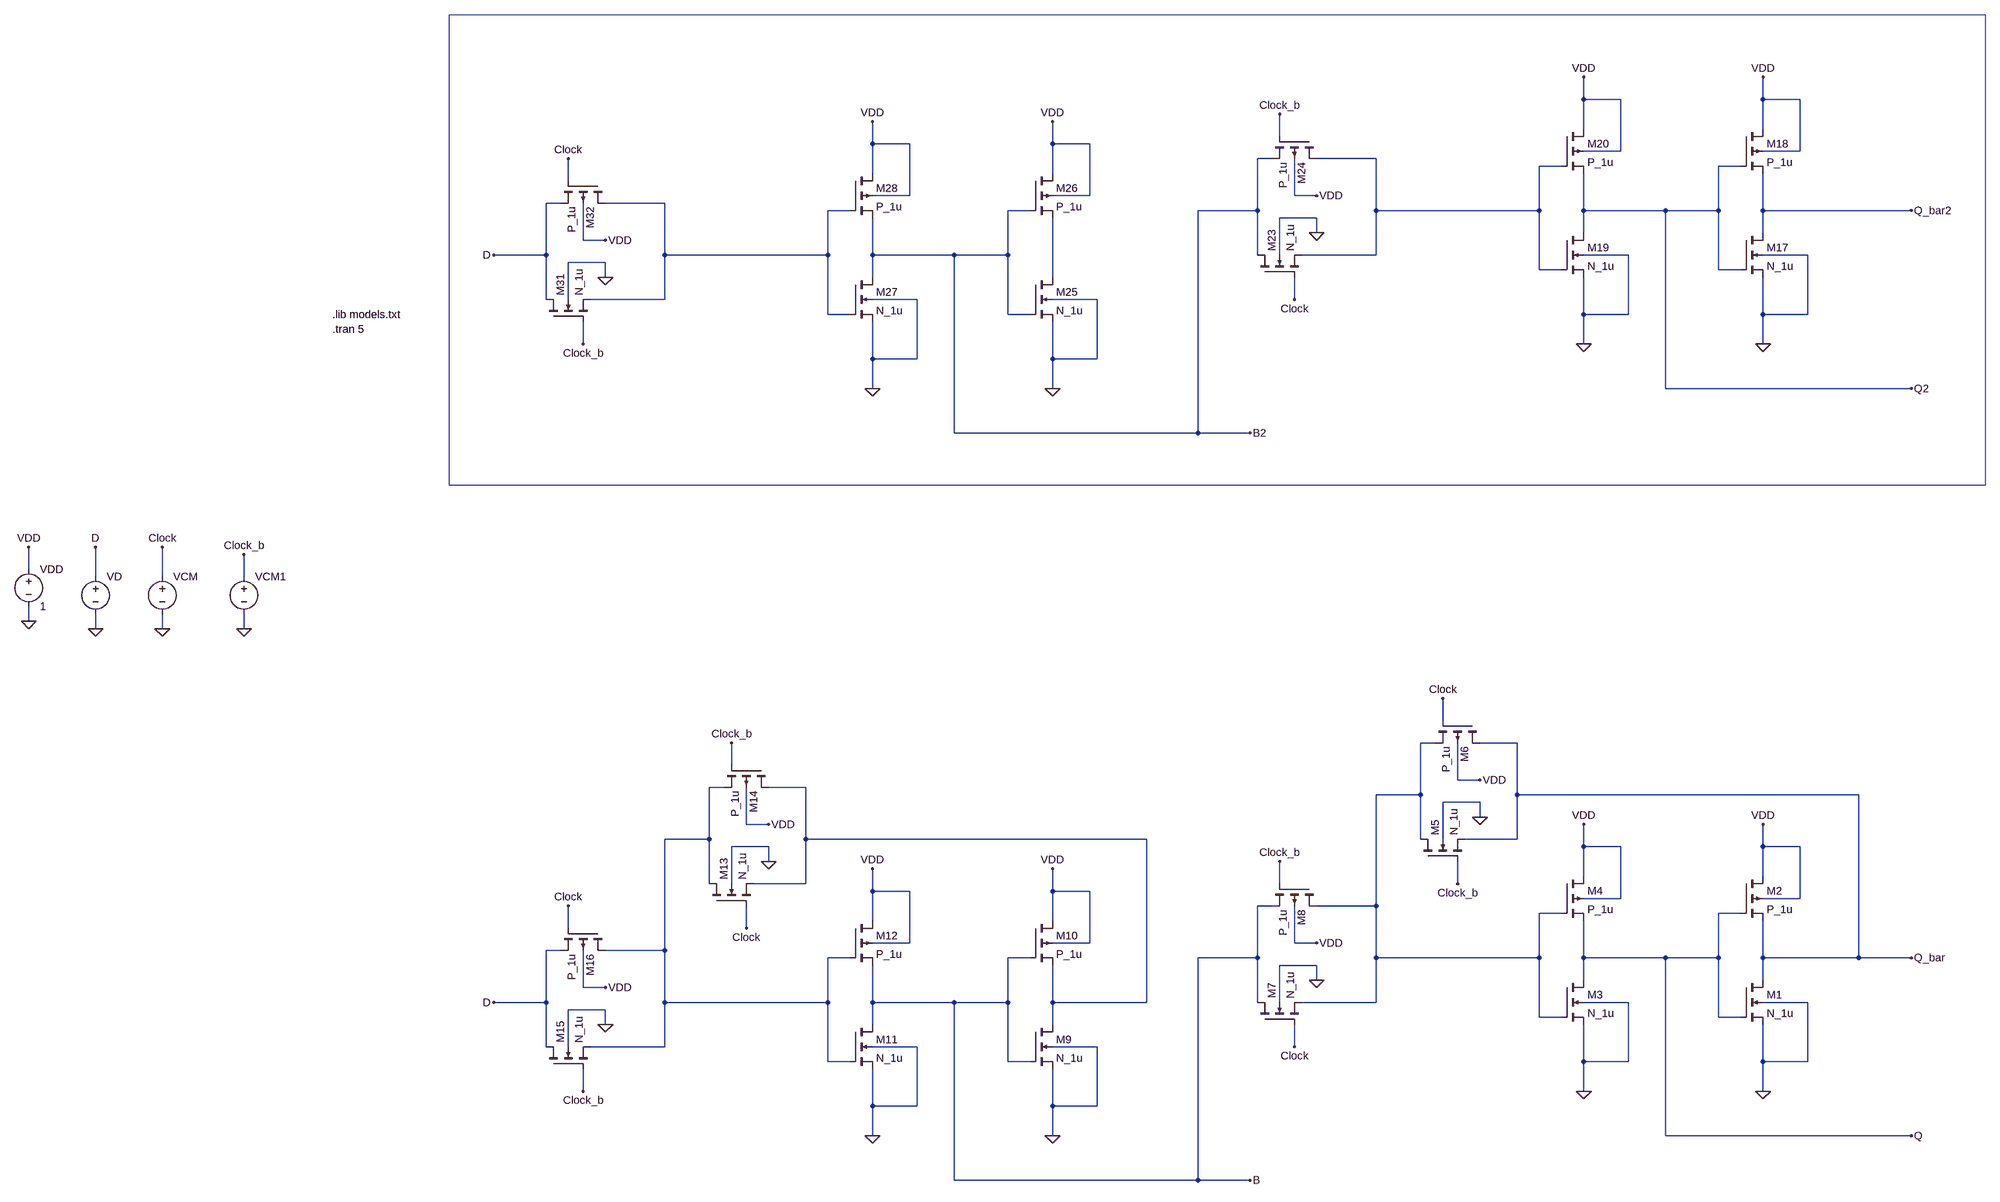
[diagram p0: schematic TP1_ej8.asc]
TP1_ej8.asc, the LTspice schematic file:
Version 4.1
SHEET 1 2084 3372
WIRE 1152 -256 1152 -304
WIRE 1232 -256 1152 -256
WIRE 1552 -256 1552 -304
WIRE 1632 -256 1552 -256
WIRE 1152 -192 1152 -256
WIRE 1552 -192 1552 -256
WIRE 496 -176 496 -224
WIRE -432 -160 -432 -208
WIRE -352 -160 -432 -160
WIRE -32 -160 -32 -208
WIRE 48 -160 -32 -160
WIRE 1232 -144 1232 -256
WIRE 1232 -144 1152 -144
WIRE 1632 -144 1632 -256
WIRE 1632 -144 1552 -144
WIRE 480 -128 448 -128
WIRE 704 -128 576 -128
WIRE 1104 -112 1056 -112
WIRE 1504 -112 1456 -112
WIRE -432 -96 -432 -160
WIRE -32 -96 -32 -160
WIRE -1088 -80 -1088 -128
WIRE -352 -48 -352 -160
WIRE -352 -48 -432 -48
WIRE 48 -48 48 -160
WIRE 48 -48 -32 -48
WIRE 528 -48 528 -128
WIRE 576 -48 528 -48
WIRE -1104 -32 -1136 -32
WIRE -880 -32 -1008 -32
WIRE -480 -16 -528 -16
WIRE -80 -16 -128 -16
WIRE 448 -16 448 -128
WIRE 448 -16 288 -16
WIRE 704 -16 704 -128
WIRE 1056 -16 1056 -112
WIRE 1056 -16 704 -16
WIRE 1152 -16 1152 -96
WIRE 1328 -16 1152 -16
WIRE 1456 -16 1456 -112
WIRE 1456 -16 1328 -16
WIRE 1552 -16 1552 -96
WIRE 1920 -16 1552 -16
WIRE 576 0 496 0
WIRE 576 32 576 0
WIRE 1152 32 1152 -16
WIRE 1552 32 1552 -16
WIRE -1056 48 -1056 -32
WIRE -1008 48 -1056 48
WIRE -1136 80 -1136 -32
WIRE -1136 80 -1344 80
WIRE -880 80 -880 -32
WIRE -528 80 -528 -16
WIRE -528 80 -880 80
WIRE -432 80 -432 0
WIRE -256 80 -432 80
WIRE -128 80 -128 -16
WIRE -128 80 -256 80
WIRE 448 80 448 -16
WIRE 496 80 496 0
WIRE 704 80 704 -16
WIRE 704 80 544 80
WIRE 1248 80 1152 80
WIRE 1648 80 1552 80
WIRE -1008 96 -1088 96
WIRE 1056 112 1056 -16
WIRE 1104 112 1056 112
WIRE 1456 112 1456 -16
WIRE 1504 112 1456 112
WIRE -1008 128 -1008 96
WIRE -432 128 -432 80
WIRE -32 128 -32 0
WIRE -1136 176 -1136 80
WIRE -1088 176 -1088 96
WIRE -880 176 -880 80
WIRE -880 176 -1040 176
WIRE -336 176 -432 176
WIRE 64 176 -32 176
WIRE 528 176 528 128
WIRE -528 208 -528 80
WIRE -480 208 -528 208
WIRE -128 208 -128 80
WIRE -80 208 -128 208
WIRE 1152 208 1152 128
WIRE 1248 208 1248 80
WIRE 1248 208 1152 208
WIRE 1552 208 1552 128
WIRE 1648 208 1648 80
WIRE 1648 208 1552 208
WIRE -1056 272 -1056 224
WIRE 1152 272 1152 208
WIRE 1552 272 1552 208
WIRE -432 304 -432 224
WIRE -336 304 -336 176
WIRE -336 304 -432 304
WIRE -32 304 -32 224
WIRE 64 304 64 176
WIRE 64 304 -32 304
WIRE -432 368 -432 304
WIRE -32 368 -32 304
WIRE 1328 368 1328 -16
WIRE 1920 368 1328 368
WIRE -256 464 -256 80
WIRE 288 464 288 -16
WIRE 288 464 -256 464
WIRE 432 464 288 464
WIRE -2800 1040 -2800 992
WIRE -2656 1056 -2656 992
WIRE -2512 1056 -2512 992
WIRE -2336 1056 -2336 1008
WIRE -2800 1152 -2800 1120
WIRE -2656 1168 -2656 1136
WIRE -2512 1168 -2512 1136
WIRE -2336 1168 -2336 1136
WIRE 848 2320 848 2272
WIRE 832 2368 800 2368
WIRE 1008 2368 928 2368
WIRE -736 2416 -736 2368
WIRE 880 2448 880 2368
WIRE 928 2448 880 2448
WIRE -752 2464 -784 2464
WIRE -576 2464 -656 2464
WIRE 800 2480 800 2368
WIRE 800 2480 704 2480
WIRE 1008 2480 1008 2368
WIRE 1760 2480 1008 2480
WIRE 928 2496 848 2496
WIRE 928 2528 928 2496
WIRE -704 2544 -704 2464
WIRE -656 2544 -704 2544
WIRE -784 2576 -784 2464
WIRE -784 2576 -880 2576
WIRE -576 2576 -576 2464
WIRE 176 2576 -576 2576
WIRE 800 2576 800 2480
WIRE 848 2576 848 2496
WIRE 1008 2576 1008 2480
WIRE 1008 2576 896 2576
WIRE -656 2592 -736 2592
WIRE 1152 2592 1152 2544
WIRE 1232 2592 1152 2592
WIRE 1552 2592 1552 2544
WIRE 1632 2592 1552 2592
WIRE -656 2624 -656 2592
WIRE 1152 2656 1152 2592
WIRE 1552 2656 1552 2592
WIRE -784 2672 -784 2576
WIRE -736 2672 -736 2592
WIRE -576 2672 -576 2576
WIRE -576 2672 -688 2672
WIRE 496 2672 496 2624
WIRE 880 2672 880 2624
WIRE -432 2688 -432 2640
WIRE -352 2688 -432 2688
WIRE -32 2688 -32 2640
WIRE 48 2688 -32 2688
WIRE 1232 2704 1232 2592
WIRE 1232 2704 1152 2704
WIRE 1632 2704 1632 2592
WIRE 1632 2704 1552 2704
WIRE 480 2720 448 2720
WIRE 704 2720 704 2480
WIRE 704 2720 576 2720
WIRE 1104 2736 1056 2736
WIRE 1504 2736 1456 2736
WIRE -432 2752 -432 2688
WIRE -32 2752 -32 2688
WIRE -1088 2768 -1088 2720
WIRE -704 2768 -704 2720
WIRE -352 2800 -352 2688
WIRE -352 2800 -432 2800
WIRE 48 2800 48 2688
WIRE 48 2800 -32 2800
WIRE 528 2800 528 2720
WIRE 576 2800 528 2800
WIRE -1104 2816 -1136 2816
WIRE -880 2816 -880 2576
WIRE -880 2816 -1008 2816
WIRE -480 2832 -528 2832
WIRE -80 2832 -128 2832
WIRE 448 2832 448 2720
WIRE 448 2832 288 2832
WIRE 704 2832 704 2720
WIRE 1056 2832 1056 2736
WIRE 1056 2832 704 2832
WIRE 1152 2832 1152 2752
WIRE 1328 2832 1152 2832
WIRE 1456 2832 1456 2736
WIRE 1456 2832 1328 2832
WIRE 1552 2832 1552 2752
WIRE 1760 2832 1760 2480
WIRE 1760 2832 1552 2832
WIRE 1920 2832 1760 2832
WIRE 576 2848 496 2848
WIRE 576 2880 576 2848
WIRE 1152 2880 1152 2832
WIRE 1552 2880 1552 2832
WIRE -1056 2896 -1056 2816
WIRE -1008 2896 -1056 2896
WIRE -1136 2928 -1136 2816
WIRE -1136 2928 -1344 2928
WIRE -880 2928 -880 2816
WIRE -528 2928 -528 2832
WIRE -528 2928 -880 2928
WIRE -432 2928 -432 2848
WIRE -256 2928 -432 2928
WIRE -128 2928 -128 2832
WIRE -128 2928 -256 2928
WIRE -32 2928 -32 2848
WIRE 176 2928 176 2576
WIRE 176 2928 -32 2928
WIRE 448 2928 448 2832
WIRE 496 2928 496 2848
WIRE 704 2928 704 2832
WIRE 704 2928 544 2928
WIRE 1248 2928 1152 2928
WIRE 1648 2928 1552 2928
WIRE -1008 2944 -1088 2944
WIRE 1056 2960 1056 2832
WIRE 1104 2960 1056 2960
WIRE 1456 2960 1456 2832
WIRE 1504 2960 1456 2960
WIRE -1008 2976 -1008 2944
WIRE -432 2976 -432 2928
WIRE -32 2976 -32 2928
WIRE -1136 3024 -1136 2928
WIRE -1088 3024 -1088 2944
WIRE -880 3024 -880 2928
WIRE -880 3024 -1040 3024
WIRE -336 3024 -432 3024
WIRE 64 3024 -32 3024
WIRE 528 3024 528 2976
WIRE -528 3056 -528 2928
WIRE -480 3056 -528 3056
WIRE -128 3056 -128 2928
WIRE -80 3056 -128 3056
WIRE 1152 3056 1152 2976
WIRE 1248 3056 1248 2928
WIRE 1248 3056 1152 3056
WIRE 1552 3056 1552 2976
WIRE 1648 3056 1648 2928
WIRE 1648 3056 1552 3056
WIRE -1056 3120 -1056 3072
WIRE 1152 3120 1152 3056
WIRE 1552 3120 1552 3056
WIRE -432 3152 -432 3072
WIRE -336 3152 -336 3024
WIRE -336 3152 -432 3152
WIRE -32 3152 -32 3072
WIRE 64 3152 64 3024
WIRE 64 3152 -32 3152
WIRE -432 3216 -432 3152
WIRE -32 3216 -32 3152
WIRE 1328 3216 1328 2832
WIRE 1920 3216 1328 3216
WIRE -256 3312 -256 2928
WIRE 288 3312 288 2832
WIRE 288 3312 -256 3312
WIRE 432 3312 288 3312
FLAG -2800 1152 0
FLAG -2800 992 VDD
FLAG 1552 3120 0
FLAG 1552 2544 VDD
FLAG 1920 2832 Q_bar
FLAG 1152 3120 0
FLAG 1152 2544 VDD
FLAG 928 2448 VDD
FLAG 928 2528 0
FLAG 848 2272 Clock
FLAG 880 2672 Clock_b
FLAG 1920 3216 Q
FLAG 576 2800 VDD
FLAG 576 2880 0
FLAG 496 2624 Clock_b
FLAG 528 3024 Clock
FLAG -32 3216 0
FLAG -32 2640 VDD
FLAG -432 3216 0
FLAG -432 2640 VDD
FLAG -656 2544 VDD
FLAG -656 2624 0
FLAG -736 2368 Clock_b
FLAG -704 2768 Clock
FLAG -1008 2896 VDD
FLAG -1008 2976 0
FLAG -1088 2720 Clock
FLAG -1056 3120 Clock_b
FLAG 432 3312 B
FLAG -1344 2928 D
FLAG -2656 1168 0
FLAG -2512 1168 0
FLAG -2336 1008 Clock_b
FLAG -2512 992 Clock
FLAG -2656 992 D
FLAG -2336 1168 0
FLAG 1552 272 0
FLAG 1552 -304 VDD
FLAG 1920 -16 Q_bar2
FLAG 1152 272 0
FLAG 1152 -304 VDD
FLAG 1920 368 Q2
FLAG 576 -48 VDD
FLAG 576 32 0
FLAG 496 -224 Clock_b
FLAG 528 176 Clock
FLAG -32 368 0
FLAG -32 -208 VDD
FLAG -432 368 0
FLAG -432 -208 VDD
FLAG -1008 48 VDD
FLAG -1008 128 0
FLAG -1088 -128 Clock
FLAG -1056 272 Clock_b
FLAG 432 464 B2
FLAG -1344 80 D
SYMBOL voltage -2800 1024 R0
SYMATTR InstName VDD
SYMATTR Value 1
SYMBOL voltage -2512 1040 R0
WINDOW 123 24 92 Left 2
WINDOW 39 0 0 Left 0
WINDOW 3 24 44 Invisible 2
SYMATTR Value PWL(0 1 100m 1 101m 0 250m 0 251m 1 300m 1 301m 0 5 0)
SYMATTR InstName VCM
SYMBOL nmos4 1504 2880 R0
SYMATTR InstName M1
SYMATTR Value N_1u
SYMATTR Value2 l=1u w=2u
SYMBOL pmos4 1504 2656 R0
SYMATTR InstName M2
SYMATTR Value2 l=1u w=4.83u
SYMATTR Value P_1u
SYMBOL nmos4 1104 2880 R0
SYMATTR InstName M3
SYMATTR Value N_1u
SYMATTR Value2 l=1u w=2u
SYMBOL pmos4 1104 2656 R0
SYMATTR InstName M4
SYMATTR Value2 l=1u w=4.83u
SYMATTR Value P_1u
SYMBOL nmos4 800 2624 R270
SYMATTR InstName M5
SYMATTR Value N_1u
SYMATTR Value2 l=1u w=2u
SYMBOL pmos4 928 2320 R90
SYMATTR InstName M6
SYMATTR Value2 l=1u w=4.83u
SYMATTR Value P_1u
SYMBOL nmos4 448 2976 R270
SYMATTR InstName M7
SYMATTR Value N_1u
SYMATTR Value2 l=1u w=2u
SYMBOL pmos4 576 2672 R90
SYMATTR InstName M8
SYMATTR Value2 l=1u w=4.83u
SYMATTR Value P_1u
SYMBOL nmos4 -80 2976 R0
SYMATTR InstName M9
SYMATTR Value N_1u
SYMATTR Value2 l=1u w=2u
SYMBOL pmos4 -80 2752 R0
SYMATTR InstName M10
SYMATTR Value2 l=1u w=4.83u
SYMATTR Value P_1u
SYMBOL nmos4 -480 2976 R0
SYMATTR InstName M11
SYMATTR Value N_1u
SYMATTR Value2 l=1u w=2u
SYMBOL pmos4 -480 2752 R0
SYMATTR InstName M12
SYMATTR Value2 l=1u w=4.83u
SYMATTR Value P_1u
SYMBOL nmos4 -784 2720 R270
SYMATTR InstName M13
SYMATTR Value N_1u
SYMATTR Value2 l=1u w=2u
SYMBOL pmos4 -656 2416 R90
SYMATTR InstName M14
SYMATTR Value2 l=1u w=4.83u
SYMATTR Value P_1u
SYMBOL nmos4 -1136 3072 R270
SYMATTR InstName M15
SYMATTR Value N_1u
SYMATTR Value2 l=1u w=2u
SYMBOL pmos4 -1008 2768 R90
SYMATTR InstName M16
SYMATTR Value2 l=1u w=4.83u
SYMATTR Value P_1u
SYMBOL voltage -2656 1040 R0
WINDOW 3 24 44 Invisible 2
WINDOW 123 0 0 Left 0
WINDOW 39 0 0 Left 0
SYMATTR Value PULSE(0 1 0 1n 1n 150m 325m)
SYMATTR InstName VD
SYMBOL voltage -2336 1040 R0
WINDOW 123 24 92 Left 2
WINDOW 39 0 0 Left 0
WINDOW 3 24 44 Invisible 2
SYMATTR Value PWL(0 0 100m 0 101m 1 250m 1 251m 0 300m 0 301m 1 5 1)
SYMATTR InstName VCM1
SYMBOL nmos4 1504 32 R0
SYMATTR InstName M17
SYMATTR Value N_1u
SYMATTR Value2 l=1u w=2u
SYMBOL pmos4 1504 -192 R0
SYMATTR InstName M18
SYMATTR Value2 l=1u w=4.83u
SYMATTR Value P_1u
SYMBOL nmos4 1104 32 R0
SYMATTR InstName M19
SYMATTR Value N_1u
SYMATTR Value2 l=1u w=2u
SYMBOL pmos4 1104 -192 R0
SYMATTR InstName M20
SYMATTR Value2 l=1u w=4.83u
SYMATTR Value P_1u
SYMBOL nmos4 448 128 R270
SYMATTR InstName M23
SYMATTR Value N_1u
SYMATTR Value2 l=1u w=2u
SYMBOL pmos4 576 -176 R90
SYMATTR InstName M24
SYMATTR Value2 l=1u w=4.83u
SYMATTR Value P_1u
SYMBOL nmos4 -80 128 R0
SYMATTR InstName M25
SYMATTR Value N_1u
SYMATTR Value2 l=1u w=2u
SYMBOL pmos4 -80 -96 R0
SYMATTR InstName M26
SYMATTR Value2 l=1u w=4.83u
SYMATTR Value P_1u
SYMBOL nmos4 -480 128 R0
SYMATTR InstName M27
SYMATTR Value N_1u
SYMATTR Value2 l=1u w=2u
SYMBOL pmos4 -480 -96 R0
SYMATTR InstName M28
SYMATTR Value2 l=1u w=4.83u
SYMATTR Value P_1u
SYMBOL nmos4 -1136 224 R270
SYMATTR InstName M31
SYMATTR Value N_1u
SYMATTR Value2 l=1u w=2u
SYMBOL pmos4 -1008 -80 R90
SYMATTR InstName M32
SYMATTR Value2 l=1u w=4.83u
SYMATTR Value P_1u
TEXT -2128 208 Left 2 !.lib models.txt
TEXT -2128 240 Left 2 !.tran 5
RECTANGLE Normal 2080 -560 -1440 688

The netlist it stands for:
* TP1_ej8.asc
VDD VDD 0 1
VCM Clock 0 PWL(0 1 100m 1 101m 0 250m 0 251m 1 300m 1 301m 0 5 0)
M1 Q_bar Q 0 0 N_1u l=1u w=2u
M2 VDD Q Q_bar VDD P_1u l=1u w=4.83u
M3 Q N004 0 0 N_1u l=1u w=2u
M4 VDD N004 Q VDD P_1u l=1u w=4.83u
M5 N004 Clock_b Q_bar 0 N_1u l=1u w=2u
M6 Q_bar Clock N004 VDD P_1u l=1u w=4.83u
M7 B Clock N004 0 N_1u l=1u w=2u
M8 N004 Clock_b B VDD P_1u l=1u w=4.83u
M9 N006 B 0 0 N_1u l=1u w=2u
M10 VDD B N006 VDD P_1u l=1u w=4.83u
M11 B N005 0 0 N_1u l=1u w=2u
M12 VDD N005 B VDD P_1u l=1u w=4.83u
M13 N005 Clock N006 0 N_1u l=1u w=2u
M14 N006 Clock_b N005 VDD P_1u l=1u w=4.83u
M15 D Clock_b N005 0 N_1u l=1u w=2u
M16 N005 Clock D VDD P_1u l=1u w=4.83u
VD D 0 PULSE(0 1 0 1n 1n 150m 325m)
VCM1 Clock_b 0 PWL(0 0 100m 0 101m 1 250m 1 251m 0 300m 0 301m 1 5 1)
M17 Q_bar2 Q2 0 0 N_1u l=1u w=2u
M18 VDD Q2 Q_bar2 VDD P_1u l=1u w=4.83u
M19 Q2 N001 0 0 N_1u l=1u w=2u
M20 VDD N001 Q2 VDD P_1u l=1u w=4.83u
M23 B2 Clock N001 0 N_1u l=1u w=2u
M24 N001 Clock_b B2 VDD P_1u l=1u w=4.83u
M25 N003 B2 0 0 N_1u l=1u w=2u
M26 VDD B2 N003 VDD P_1u l=1u w=4.83u
M27 B2 N002 0 0 N_1u l=1u w=2u
M28 VDD N002 B2 VDD P_1u l=1u w=4.83u
M31 D Clock_b N002 0 N_1u l=1u w=2u
M32 N002 Clock D VDD P_1u l=1u w=4.83u
.model NMOS NMOS
.model PMOS PMOS
.lib standard.mos
.lib models.txt
.tran 5
.backanno
.end